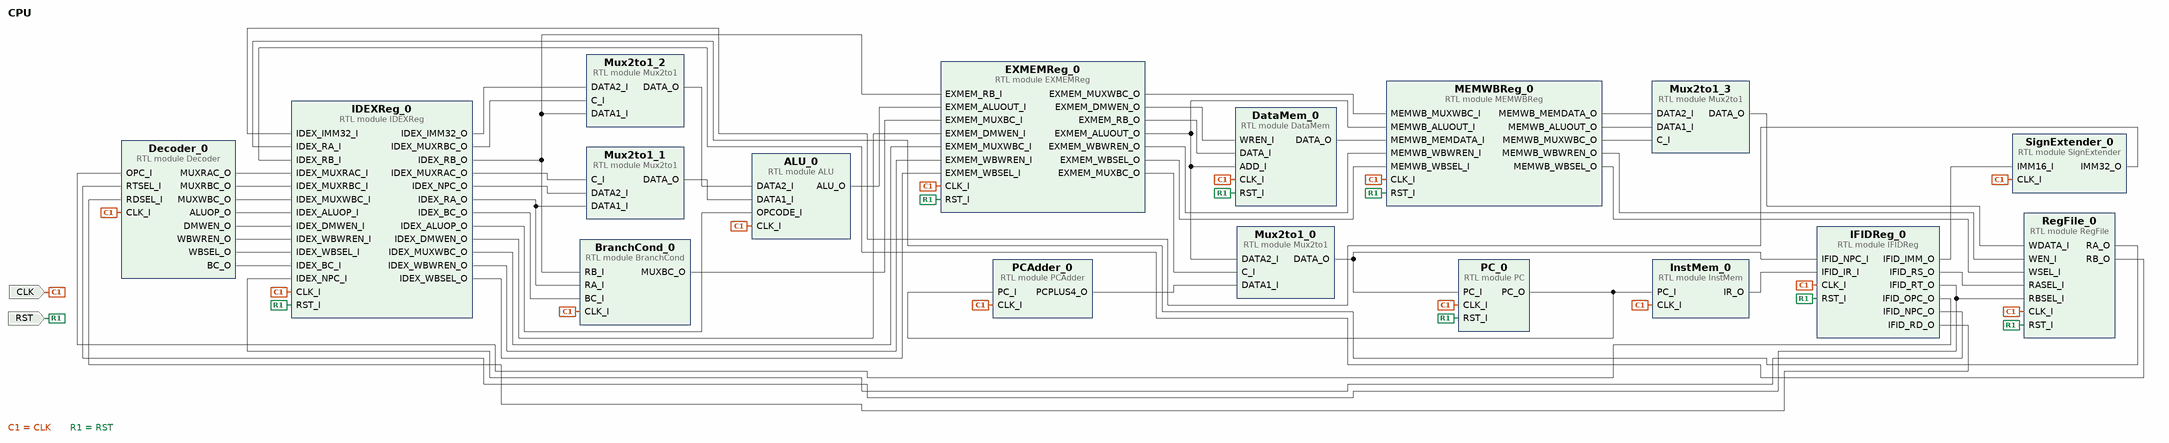
[diagram p0: block diagram of the top level]
# Vivado block design CPU, Vivado 2016.1
create_bd_design CPU

create_bd_port -dir I CLK
create_bd_port -dir I RST

create_bd_cell -type module -reference PC PC_0
create_bd_cell -type module -reference Mux2to1 Mux2to1_0
create_bd_cell -type module -reference MEMWBReg MEMWBReg_0
create_bd_cell -type module -reference PCAdder PCAdder_0
create_bd_cell -type module -reference DataMem DataMem_0
create_bd_cell -type module -reference EXMEMReg EXMEMReg_0
create_bd_cell -type module -reference BranchCond BranchCond_0
create_bd_cell -type module -reference IDEXReg IDEXReg_0
create_bd_cell -type module -reference SignExtender SignExtender_0
create_bd_cell -type module -reference IFIDReg IFIDReg_0
create_bd_cell -type module -reference InstMem InstMem_0
create_bd_cell -type module -reference ALU ALU_0
create_bd_cell -type module -reference RegFile RegFile_0
create_bd_cell -type module -reference Decoder Decoder_0
create_bd_cell -type module -reference Mux2to1 Mux2to1_1
create_bd_cell -type module -reference Mux2to1 Mux2to1_2
create_bd_cell -type module -reference Mux2to1 Mux2to1_3

# ---- connections ----

connect_bd_net [get_bd_pins PC_0/PC_O] [get_bd_pins PCAdder_0/PC_I] [get_bd_pins InstMem_0/PC_I]
connect_bd_net [get_bd_pins InstMem_0/IR_O] [get_bd_pins IFIDReg_0/IFID_IR_I]
connect_bd_net [get_bd_pins IFIDReg_0/IFID_IMM_O] [get_bd_pins SignExtender_0/IMM16_I]
connect_bd_net [get_bd_pins IFIDReg_0/IFID_RS_O] [get_bd_pins RegFile_0/RASEL_I]
connect_bd_net [get_bd_pins IFIDReg_0/IFID_OPC_O] [get_bd_pins Decoder_0/OPC_I]
connect_bd_net [get_bd_pins SignExtender_0/IMM32_O] [get_bd_pins IDEXReg_0/IDEX_IMM32_I]
connect_bd_net [get_bd_pins RegFile_0/RA_O] [get_bd_pins IDEXReg_0/IDEX_RA_I]
connect_bd_net [get_bd_pins RegFile_0/RB_O] [get_bd_pins IDEXReg_0/IDEX_RB_I]
connect_bd_net [get_bd_pins Decoder_0/MUXRAC_O] [get_bd_pins IDEXReg_0/IDEX_MUXRAC_I]
connect_bd_net [get_bd_pins Decoder_0/MUXRBC_O] [get_bd_pins IDEXReg_0/IDEX_MUXRBC_I]
connect_bd_net [get_bd_pins Decoder_0/MUXWBC_O] [get_bd_pins IDEXReg_0/IDEX_MUXWBC_I]
connect_bd_net [get_bd_pins Decoder_0/ALUOP_O] [get_bd_pins IDEXReg_0/IDEX_ALUOP_I]
connect_bd_net [get_bd_pins Decoder_0/DMWEN_O] [get_bd_pins IDEXReg_0/IDEX_DMWEN_I]
connect_bd_net [get_bd_pins IFIDReg_0/IFID_NPC_O] [get_bd_pins IDEXReg_0/IDEX_NPC_I]
connect_bd_net [get_bd_pins PCAdder_0/PCPLUS4_O] [get_bd_pins Mux2to1_0/DATA1_I]
connect_bd_net [get_bd_pins Mux2to1_0/DATA_O] [get_bd_pins PC_0/PC_I] [get_bd_pins IFIDReg_0/IFID_NPC_I]
connect_bd_net [get_bd_pins IDEXReg_0/IDEX_RA_O] [get_bd_pins BranchCond_0/RA_I] [get_bd_pins Mux2to1_1/DATA1_I]
connect_bd_net [get_bd_pins IDEXReg_0/IDEX_RB_O] [get_bd_pins EXMEMReg_0/EXMEM_RB_I] [get_bd_pins BranchCond_0/RB_I] [get_bd_pins Mux2to1_2/DATA1_I]
connect_bd_net [get_bd_pins IDEXReg_0/IDEX_IMM32_O] [get_bd_pins Mux2to1_2/DATA2_I]
connect_bd_net [get_bd_pins Mux2to1_1/DATA_O] [get_bd_pins ALU_0/DATA1_I]
connect_bd_net [get_bd_pins Mux2to1_2/DATA_O] [get_bd_pins ALU_0/DATA2_I]
connect_bd_net [get_bd_pins IDEXReg_0/IDEX_MUXRAC_O] [get_bd_pins Mux2to1_1/C_I]
connect_bd_net [get_bd_pins ALU_0/ALU_O] [get_bd_pins EXMEMReg_0/EXMEM_ALUOUT_I]
connect_bd_net [get_bd_pins IDEXReg_0/IDEX_NPC_O] [get_bd_pins Mux2to1_1/DATA2_I]
connect_bd_net [get_bd_pins IDEXReg_0/IDEX_DMWEN_O] [get_bd_pins EXMEMReg_0/EXMEM_DMWEN_I]
connect_bd_net [get_bd_pins IDEXReg_0/IDEX_MUXWBC_O] [get_bd_pins EXMEMReg_0/EXMEM_MUXWBC_I]
connect_bd_net [get_bd_pins EXMEMReg_0/EXMEM_DMWEN_O] [get_bd_pins DataMem_0/WREN_I]
connect_bd_net [get_bd_pins EXMEMReg_0/EXMEM_ALUOUT_O] \
  [get_bd_pins MEMWBReg_0/MEMWB_ALUOUT_I] [get_bd_pins DataMem_0/ADD_I] [get_bd_pins Mux2to1_0/DATA2_I]
connect_bd_net [get_bd_pins DataMem_0/DATA_O] [get_bd_pins MEMWBReg_0/MEMWB_MEMDATA_I]
connect_bd_net [get_bd_pins EXMEMReg_0/EXMEM_RB_O] [get_bd_pins DataMem_0/DATA_I]
connect_bd_net [get_bd_pins EXMEMReg_0/EXMEM_MUXWBC_O] [get_bd_pins MEMWBReg_0/MEMWB_MUXWBC_I]
connect_bd_net -net MEMWBReg_0_MEMWB_WBDATA_O [get_bd_pins Mux2to1_3/DATA_O] [get_bd_pins RegFile_0/WDATA_I]
connect_bd_net -net MEMWBReg_0_MEMWB_WBEN_O [get_bd_pins MEMWBReg_0/MEMWB_WBWREN_O] [get_bd_pins RegFile_0/WEN_I]
connect_bd_net [get_bd_pins Decoder_0/WBWREN_O] [get_bd_pins IDEXReg_0/IDEX_WBWREN_I]
connect_bd_net [get_bd_pins IDEXReg_0/IDEX_WBWREN_O] [get_bd_pins EXMEMReg_0/EXMEM_WBWREN_I]
connect_bd_net [get_bd_pins EXMEMReg_0/EXMEM_WBWREN_O] [get_bd_pins MEMWBReg_0/MEMWB_WBWREN_I]
connect_bd_net -net EXMEMReg_0_EXMEM_RBSEL_O [get_bd_pins EXMEMReg_0/EXMEM_WBSEL_O] [get_bd_pins MEMWBReg_0/MEMWB_WBSEL_I]
connect_bd_net [get_bd_pins MEMWBReg_0/MEMWB_MEMDATA_O] [get_bd_pins Mux2to1_3/DATA2_I]
connect_bd_net [get_bd_pins MEMWBReg_0/MEMWB_ALUOUT_O] [get_bd_pins Mux2to1_3/DATA1_I]
connect_bd_net [get_bd_pins MEMWBReg_0/MEMWB_MUXWBC_O] [get_bd_pins Mux2to1_3/C_I]
connect_bd_net [get_bd_pins MEMWBReg_0/MEMWB_WBSEL_O] [get_bd_pins RegFile_0/WSEL_I]
connect_bd_net [get_bd_ports CLK] \
  [get_bd_pins PC_0/CLK_I] [get_bd_pins MEMWBReg_0/CLK_I] [get_bd_pins PCAdder_0/CLK_I] [get_bd_pins DataMem_0/CLK_I] \
  [get_bd_pins EXMEMReg_0/CLK_I] [get_bd_pins BranchCond_0/CLK_I] [get_bd_pins IDEXReg_0/CLK_I] \
  [get_bd_pins SignExtender_0/CLK_I] [get_bd_pins IFIDReg_0/CLK_I] [get_bd_pins InstMem_0/CLK_I] [get_bd_pins ALU_0/CLK_I] \
  [get_bd_pins RegFile_0/CLK_I] [get_bd_pins Decoder_0/CLK_I]
connect_bd_net [get_bd_ports RST] \
  [get_bd_pins PC_0/RST_I] [get_bd_pins MEMWBReg_0/RST_I] [get_bd_pins DataMem_0/RST_I] [get_bd_pins EXMEMReg_0/RST_I] \
  [get_bd_pins IDEXReg_0/RST_I] [get_bd_pins IFIDReg_0/RST_I] [get_bd_pins RegFile_0/RST_I]
connect_bd_net [get_bd_pins IDEXReg_0/IDEX_MUXRBC_O] [get_bd_pins Mux2to1_2/C_I]
connect_bd_net [get_bd_pins IFIDReg_0/IFID_RT_O] [get_bd_pins RegFile_0/RBSEL_I] [get_bd_pins Decoder_0/RTSEL_I]
connect_bd_net [get_bd_pins IFIDReg_0/IFID_RD_O] [get_bd_pins Decoder_0/RDSEL_I]
connect_bd_net [get_bd_pins Decoder_0/WBSEL_O] [get_bd_pins IDEXReg_0/IDEX_WBSEL_I]
connect_bd_net [get_bd_pins IDEXReg_0/IDEX_WBSEL_O] [get_bd_pins EXMEMReg_0/EXMEM_WBSEL_I]
connect_bd_net [get_bd_pins Decoder_0/BC_O] [get_bd_pins IDEXReg_0/IDEX_BC_I]
connect_bd_net [get_bd_pins IDEXReg_0/IDEX_BC_O] [get_bd_pins BranchCond_0/BC_I]
connect_bd_net [get_bd_pins BranchCond_0/MUXBC_O] [get_bd_pins EXMEMReg_0/EXMEM_MUXBC_I]
connect_bd_net [get_bd_pins EXMEMReg_0/EXMEM_MUXBC_O] [get_bd_pins Mux2to1_0/C_I]
connect_bd_net [get_bd_pins IDEXReg_0/IDEX_ALUOP_O] [get_bd_pins ALU_0/OPCODE_I]

validate_bd_design
save_bd_design
